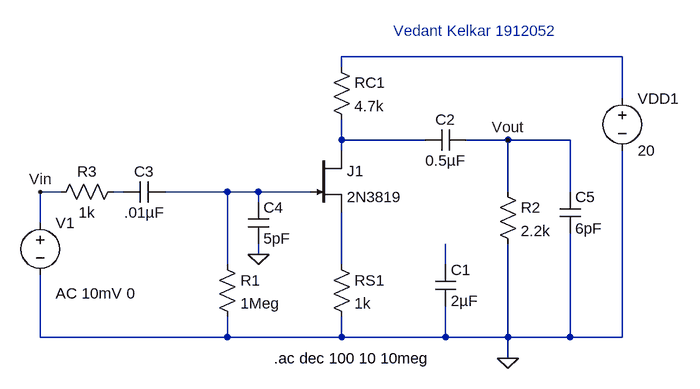
[diagram p0: schematic ECAD_exp2b.asc]
ECAD_exp2b.asc, the LTspice schematic file:
Version 4
SHEET 1 880 680
WIRE 672 -32 240 -32
WIRE 240 -16 240 -32
WIRE 672 32 672 -32
WIRE 240 96 240 64
WIRE 368 96 240 96
WIRE 496 96 432 96
WIRE 592 96 496 96
WIRE 240 112 240 96
WIRE -192 176 -224 176
WIRE -96 176 -112 176
WIRE 64 176 -32 176
WIRE 112 176 64 176
WIRE 192 176 112 176
WIRE 496 176 496 96
WIRE 592 176 592 96
WIRE 112 192 112 176
WIRE -224 224 -224 176
WIRE 112 272 112 256
WIRE 64 288 64 176
WIRE 240 288 240 208
WIRE 400 288 400 256
WIRE -224 400 -224 304
WIRE 64 400 64 368
WIRE 64 400 -224 400
WIRE 240 400 240 368
WIRE 240 400 64 400
WIRE 400 400 400 352
WIRE 400 400 240 400
WIRE 496 400 496 256
WIRE 496 400 400 400
WIRE 592 400 592 240
WIRE 592 400 496 400
WIRE 672 400 672 112
WIRE 672 400 592 400
WIRE 496 432 496 400
FLAG -224 176 Vin
FLAG 496 96 Vout
FLAG 496 432 0
FLAG 112 272 0
SYMBOL res 224 -32 R0
SYMATTR InstName RC1
SYMATTR Value 4.7k
SYMBOL res 48 272 R0
SYMATTR InstName R1
SYMATTR Value 1Meg
SYMBOL res 224 272 R0
SYMATTR InstName RS1
SYMATTR Value 1k
SYMBOL res 480 160 R0
SYMATTR InstName R2
SYMATTR Value 2.2k
SYMBOL cap 384 288 R0
SYMATTR InstName C1
SYMATTR Value 2µF
SYMBOL cap 432 80 R90
WINDOW 0 0 32 VBottom 2
WINDOW 3 32 32 VTop 2
SYMATTR InstName C2
SYMATTR Value 0.5µF
SYMBOL cap -32 160 R90
WINDOW 0 0 32 VBottom 2
WINDOW 3 32 32 VTop 2
SYMATTR InstName C3
SYMATTR Value .01µF
SYMBOL voltage -224 208 R0
WINDOW 123 24 124 Left 2
WINDOW 39 0 0 Left 0
SYMATTR Value2 AC 10mV 0
SYMATTR InstName V1
SYMATTR Value ""
SYMBOL voltage 672 16 R0
WINDOW 123 0 0 Left 0
WINDOW 39 0 0 Left 0
SYMATTR InstName VDD1
SYMATTR Value 20
SYMBOL res -96 160 R90
WINDOW 0 0 56 VBottom 2
WINDOW 3 32 56 VTop 2
SYMATTR InstName R3
SYMATTR Value 1k
SYMBOL cap 96 192 R0
SYMATTR InstName C4
SYMATTR Value 5pF
SYMBOL cap 576 176 R0
SYMATTR InstName C5
SYMATTR Value 6pF
SYMBOL njf 192 112 R0
SYMATTR InstName J1
SYMATTR Value 2N3819
TEXT 136 432 Left 2 !.ac dec 100 10 10meg
TEXT 320 -72 Left 2 ;Vedant Kelkar 1912052

The netlist it stands for:
* ECAD_exp2b.asc
RC1 N001 N002 4.7k
R1 N004 0 1Meg
RS1 N005 0 1k
R2 Vout 0 2.2k
C1 N006 0 2µF
C2 Vout N002 0.5µF
C3 N004 N003 .01µF
V1 Vin 0 AC 10mV 0
VDD1 N001 0 20
R3 N003 Vin 1k
C4 N004 0 5pF
C5 Vout 0 6pF
J1 N002 N004 N005 2N3819
.model NJF NJF
.model PJF PJF
.lib standard.jft
.ac dec 100 10 10meg
* Vedant Kelkar 1912052
.backanno
.end